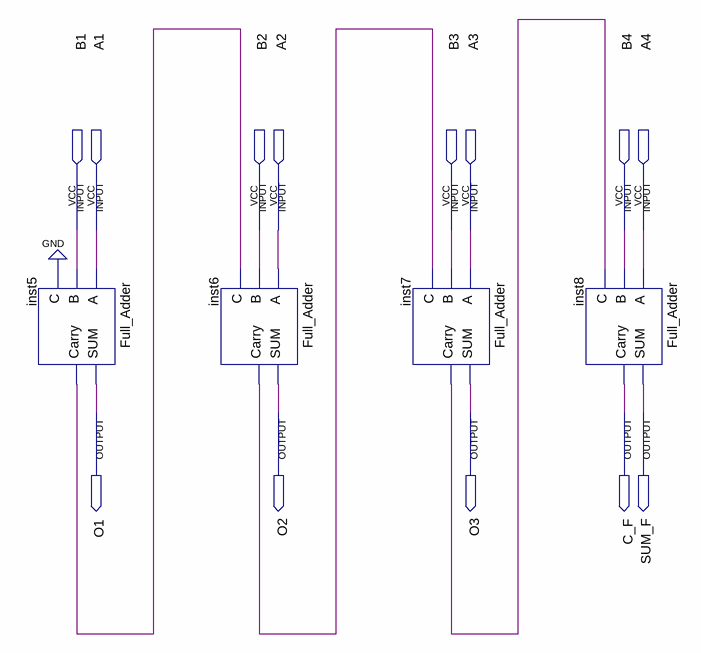
[diagram p0: schematic sheet]
// Quartus schematic Multi_Fulladder.bdf as structural Verilog: 4 symbols, 13 pins
module Multi_Fulladder (
  input  B1,
  input  A1,
  input  B2,
  input  A2,
  input  B3,
  input  A3,
  input  B4,
  input  A4,
  output O1,
  output O2,
  output O3,
  output C_F,
  output SUM_F
);

  wire inst5_carry, inst6_carry, inst7_carry;

  Full_Adder inst5 (.A(A1), .B(B1), .C(1'b0), .SUM(O1), .Carry(inst5_carry));
  Full_Adder inst6 (.A(A2), .B(B2), .C(inst5_carry), .SUM(O2), .Carry(inst6_carry));
  Full_Adder inst7 (.A(A3), .B(B3), .C(inst6_carry), .SUM(O3), .Carry(inst7_carry));
  Full_Adder inst8 (.A(A4), .B(B4), .C(inst7_carry), .SUM(SUM_F), .Carry(C_F));
endmodule
